# Altium schematic sheet LED节能灯电路模块.SchDoc
size A4
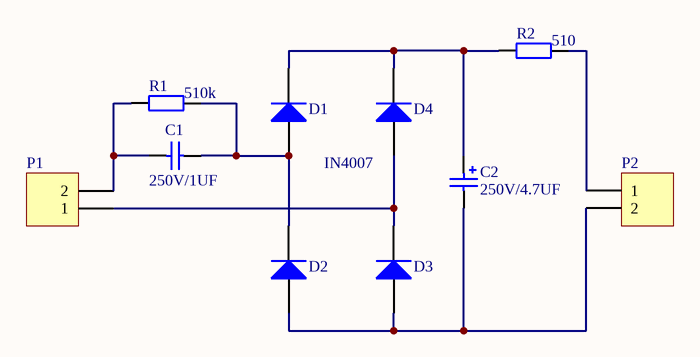
[diagram p0: LED节能灯电路模块.SchDoc]

## Parts
C1  250V/1UF  [CP_CBB]
C2  250V/4.7UF  [C-DJ-6]
D1  IN4007  [D-ZL-10]
D2  IN4007  [D-ZL-10]  (value not drawn)
D3  IN4007  [D-ZL-10]  (value not drawn)
D4  IN4007  [D-ZL-10]  (value not drawn)
P1  PZ_2  [HDR-2]  (value not drawn)
P2  PZ_2  [HDR-2]  (value not drawn)
R1  value 510k  [AXIAL-0.4]  (hidden comment: Res)
R2  value 510  [AXIAL-0.4]  (hidden comment: Res)

## Nets
NetC1_1: C1.1 P1.2 R1.1
NetC1_2: C1.2 D1.1(A) D2.2(K) R1.2
NetC2_1: C2.1 D1.2(K) D4.2(K) R2.1
NetC2_2: C2.2 D2.1(A) D3.1(A) P2.2
NetD3_2: D3.2(K) D4.1(A) P1.1
NetP2_1: P2.1 R2.2

## Library data of the parts
C1 = CPDR: 瓷片电容; Value: 104; Published: 8-Jun-2000; LatestRevisionDate: 17-Jul-2002; LatestRevisionNote: Re-released for DXP Platform.; Publisher: Altium Limited
C2 = DJDR: 电解电容; Value: 3.3uF; Published: 8-Jun-2000; LatestRevisionDate: 17-Jul-2002; LatestRevisionNote: Re-released for DXP Platform.; Publisher: Altium Limited
D1-D4 = ZL2JG: 整流二极管; Published: 8-Jun-2000; LatestRevisionDate: 17-Jul-2002; LatestRevisionNote: Re-released for DXP Platform.; DatasheetDocument: 1998; PackageDocument: Aug-1999; PackageReference: DO-201AD; Publisher: Altium Limited
P1 P2 = PZ_2: 排针——2; LatestRevisionDate: 17-Jul-2002; LatestRevisionNote: Re-released for DXP Platform.; Publisher: Altium Limited
R1 R2 = Res: 电阻; Published: 8-Jun-2000; LatestRevisionDate: 17-Jul-2002; LatestRevisionNote: Re-released for DXP Platform.; Publisher: Altium Limited